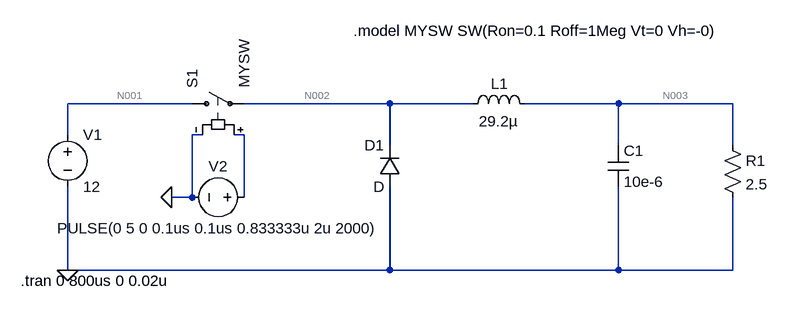
[diagram p0: schematic Buck_Ideal.asc]
Buck_Ideal.asc, the LTspice schematic file:
Version 4.1
SHEET 1 880 680
WIRE -576 48 -768 48
WIRE -272 48 -496 48
WIRE -144 48 -272 48
WIRE 80 48 -64 48
WIRE 256 48 80 48
WIRE -768 96 -768 48
WIRE -560 96 -576 96
WIRE -496 96 -512 96
WIRE -272 112 -272 48
WIRE 80 112 80 48
WIRE 256 112 256 48
WIRE -576 192 -576 96
WIRE -576 192 -608 192
WIRE -496 192 -496 96
WIRE -768 304 -768 176
WIRE -272 304 -272 176
WIRE -272 304 -768 304
WIRE 80 304 80 176
WIRE 80 304 -272 304
WIRE 256 304 256 192
WIRE 256 304 80 304
FLAG -768 304 0
FLAG -608 192 0
SYMBOL res 240 96 R0
SYMATTR InstName R1
SYMATTR Value 2.5
SYMBOL cap 64 112 R0
SYMATTR InstName C1
SYMATTR Value 10e-6
SYMBOL ind -160 64 R270
WINDOW 0 31 57 VTop 2
WINDOW 3 5 56 VBottom 2
SYMATTR InstName L1
SYMATTR Value 29.2µ
SYMBOL diode -256 176 R180
WINDOW 0 24 64 Left 2
WINDOW 3 24 0 Left 2
SYMATTR InstName D1
SYMBOL voltage -768 80 R0
WINDOW 123 0 0 Left 0
WINDOW 39 0 0 Left 0
SYMATTR InstName V1
SYMATTR Value 12
SYMBOL voltage -480 192 R90
WINDOW 0 -32 56 VBottom 2
WINDOW 3 32 56 VTop 2
WINDOW 123 0 0 Left 0
WINDOW 39 0 0 Left 0
SYMATTR InstName V2
SYMATTR Value PULSE(0 5 0 0.1us 0.1us 0.833333u 2u 2000)
SYMBOL sw -592 48 R270
SYMATTR InstName S1
SYMATTR Value MYSW
TEXT -840 320 Left 2 !.tran 0 800us 0 0.02u
TEXT -328 -64 Left 2 !.model MYSW SW(Ron=0.1 Roff=1Meg Vt=0 Vh=-0)

The netlist it stands for:
* Buck_Ideal.asc
R1 N003 0 2.5
C1 N003 0 10e-6
L1 N002 N003 29.2µ
D1 0 N002 D
V1 N001 0 12
V2 N004 0 PULSE(0 5 0 0.1us 0.1us 0.833333u 2u 2000)
S1 N001 N002 N004 0 MYSW
.model D D
.lib standard.dio
.tran 0 800us 0 0.02u
.model MYSW SW(Ron=0.1 Roff=1Meg Vt=0 Vh=-0)
.backanno
.end

* Results of the author's LTspice run, read from the files saved beside the schematic
* Operating Point, zero values left out:
*   V(n001) = 12 V
*   V(n002) = 30.01 µV
*   V(n003) = 30 µV
*   I(L1) = 12 µA
*   I(R1) = 12 µA
*   I(S1) = -12 µA
*   I(V1) = -12 µA
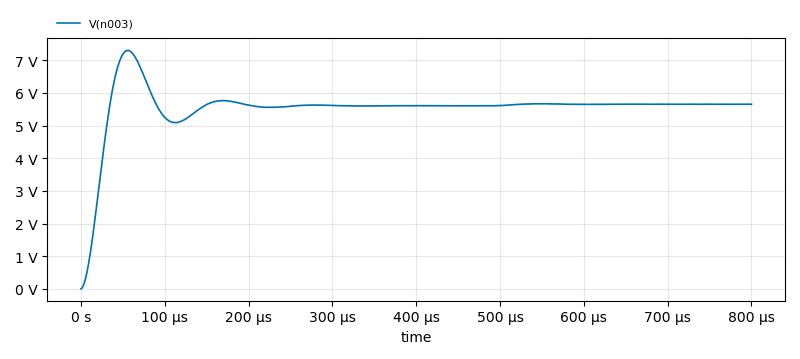
[diagram p1: Transient Analysis of Buck_Ideal.asc, plotted from the saved traces]
* Transient Analysis, 1 run:
*   V(n003): min 30 µV, max 7.306 V, average 5.545 V, rms 5.606 V, last 5.655 V